# EasyEDA Pro project PRJ_Feeder.epro, board Rail_PCB
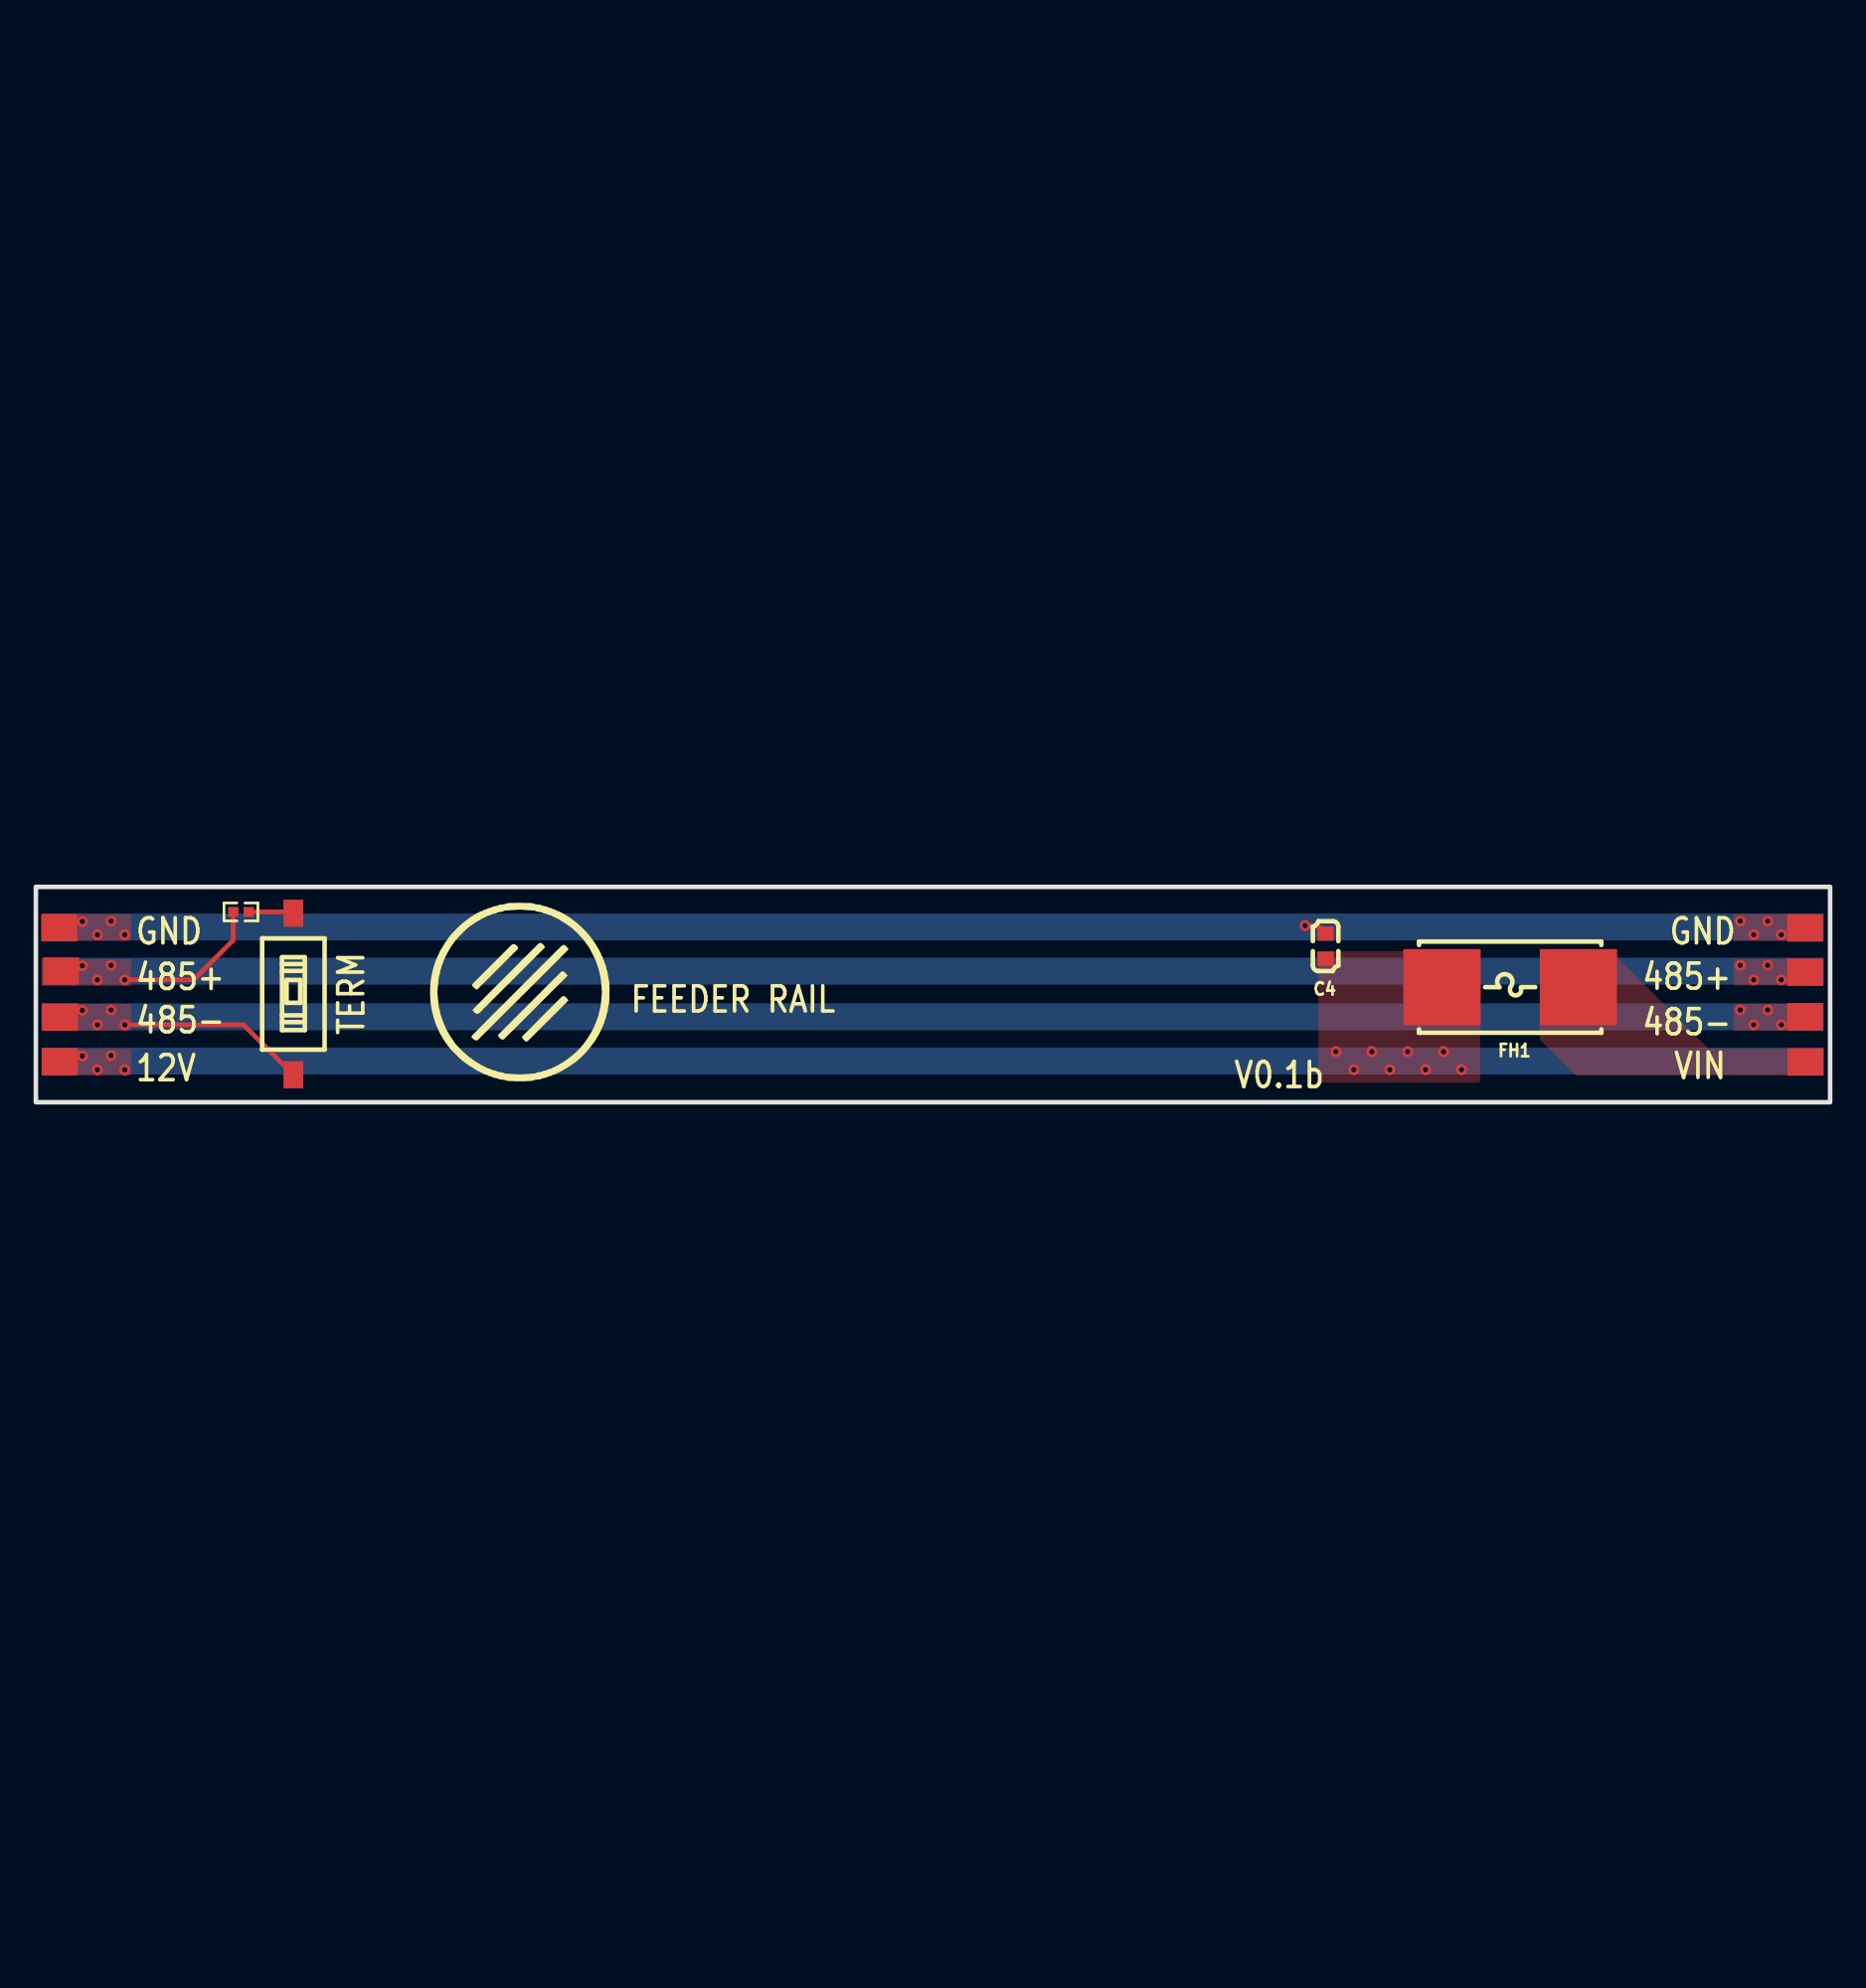
[diagram p8: board, top side]
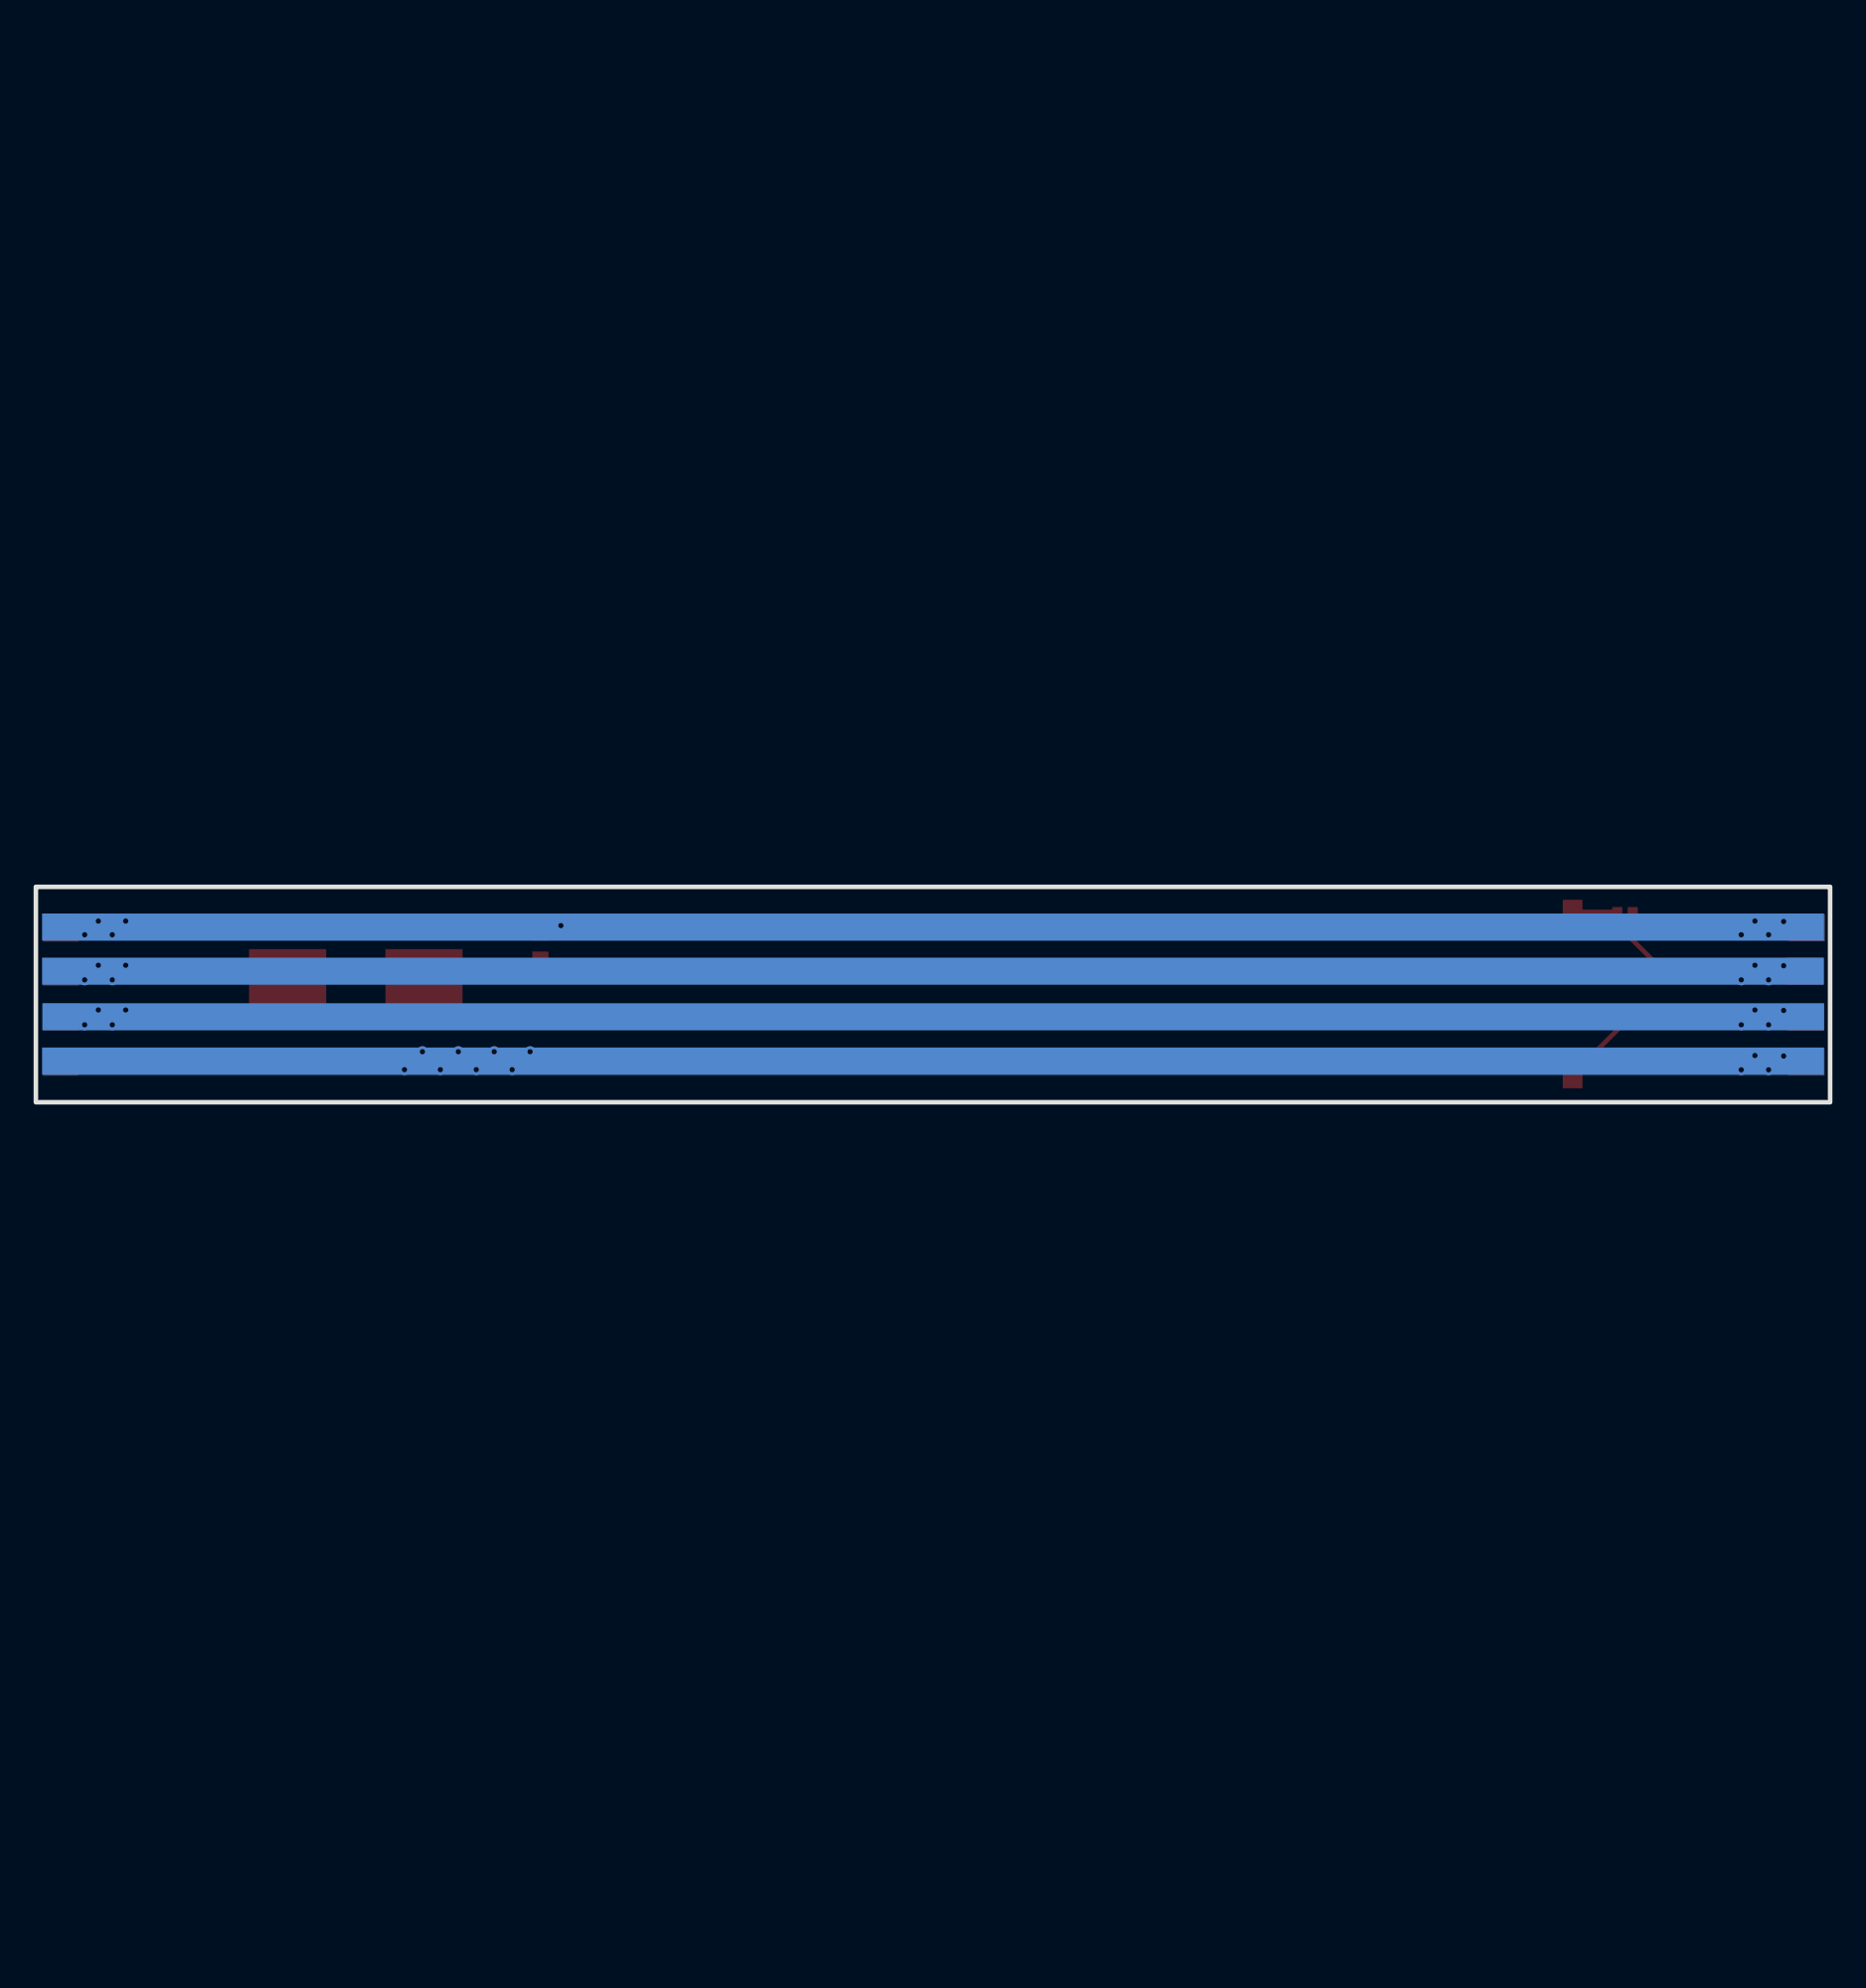
[diagram p9: board, bottom side, seen from below]

Outline 100 x 12 mm; copper layers: Top Layer, Bottom Layer. Coordinates in mm from the lower left corner of the outline.
Outline path: rectangle 0,12 100,0
Stack: Top Layer 0.035mm / Dielectric1 1.51mm FR4 er 4.5 / Bottom Layer 0.035mm

## Design rules (mm)
template: Custom Config
spacing copperThickness1oz (default): track to track 0.102, other pairs 0.152 to 0.3
spacing copperThickness2oz: track to track 0.203, other pairs 0.152 to 0.3
track width copperThickness1oz (default): min 0.127, default 0.254, max 2.54
track width copperThickness2oz: min 0.203, default 0.254, max 2.54
differential pair differentialPair (default): width min 0.127, default 0.254, max 2.54; gap min 0.152, default 0.152
via viaSize (default): diameter min 0.5, default 0.61, max 10; hole min 0.3, default 0.305, max 6.3

## Placement (name value [footprint] x y rotation side)
C4  10uF  [C0603]  71.88 8.7 270 top
FH1  01550900M  [FUSE-SMD_L9.8-W5.0]  82.17 6.41 0 top
NOREF  -  [Pad_e257]  98.63 2.25 0 top
NOREF#2  -  [Pad_e261]  1.4 7.3 0 top
NOREF#3  -  [Pad_e265]  50 7.3 0 top
NOREF#4  -  [Pad_e266]  49.99 4.76 0 top
NOREF#5  -  [Pad_e253]  98.6 9.71 0 top
NOREF#6  -  [Pad_e267]  50 2.3 0 top
NOREF#7  -  [Pad_e260]  1.35 4.74 0 top
NOREF#8  -  [Pad_e264]  50 9.77 0 top
NOREF#9  -  [Pad_e256]  98.6 4.76 0 top
NOREF#10  -  [Pad_e255]  98.6 7.25 0 top
NOREF#11  -  [Pad_e262]  1.33 2.26 0 top
NOREF#12  -  [Pad_e259]  1.3 9.73 0 top
R1  120Ω  [R0402]  11.43 10.6 180 top
SW1  DSIC01LS-P  [SW-SMD_2P-L3.5-W6.2-P2.54-LS9.8]  14.35 6.03 90 top

## Footprints (pads in the part's own frame, mm; a bottom-side part is the same pattern mirrored in y, then rotated)
C0603
  rect 0.8x0.9 smd: 1(-0.7,0) 2(0.7,0)
FUSE-SMD_L9.8-W5.0
  rect 4.3x4.24 smd: 1(-3.8,0) 2(3.8,0)
Pad_e253
  rect 2x1.524 smd: 1(0,0)
Pad_e255
  rect 2x1.524 smd: 1(0,0)
Pad_e256
  rect 2x1.524 smd: 1(0,0)
Pad_e257
  rect 2x1.524 smd: 1(0,0)
Pad_e259
  rect 2x1.524 smd: 1(0,0)
Pad_e260
  rect 2x1.524 smd: 1(0,0)
Pad_e261
  rect 2x1.524 smd: 1(0,0)
Pad_e262
  rect 2x1.524 smd: 1(0,0)
Pad_e264
  rect 99.3x1.5 smd far side: 1(0,0)
Pad_e265
  rect 99.3x1.5 smd far side: 1(0,0)
Pad_e266
  rect 99.3x1.5 smd far side: 1(0,0)
Pad_e267
  rect 99.3x1.5 smd far side: 1(0,0)
R0402
  rect 0.566x0.54 smd: 1(-0.433,0) 2(0.433,0)
SW-SMD_2P-L3.5-W6.2-P2.54-LS9.8
  rect 1.5x1.1 smd: 1(-4.5,0) 2(4.5,0)

## Nets
12V: C4.2 FH1.1 NOREF#6.1 NOREF#11.1
GND: C4.1 NOREF#5.1 NOREF#8.1 NOREF#12.1
VIN: FH1.2 NOREF.1
485+: NOREF#2.1 NOREF#3.1 NOREF#10.1 R1.2
485-: NOREF#4.1 NOREF#7.1 NOREF#9.1 SW1.1
$1N358: R1.1 SW1.2

## Via types
v1: diameter 0.61, hole 0.305, Top Layer to Bottom Layer, 37 vias

## Routing (per net, layer and track width the routed paths; a pad name or vN(x,y) marks a point on that pad's centre or on a via; arc(x,y) is an arc through that point)
12V:
  vias: v1(2.59,2.58) v1(3.43,1.81) v1(4.19,2.6) v1(4.95,1.81) v1(72.46,2.82) v1(73.46,1.82) v1(74.46,2.82) v1(75.46,1.82) v1(76.46,2.82) v1(77.46,1.82) v1(78.46,2.82) v1(79.46,1.82)
GND: length 1.3
  Top Layer w0.254: v1(70.74,9.84) 71.44,9.84 C4.1
  vias: v1(2.59,10.07) v1(3.43,9.33) v1(4.19,10.09) v1(4.95,9.33) v1(95,10.09) v1(95.74,9.33) v1(96.52,10.09) v1(97.28,9.33)
485+: length 8.5
  Top Layer w0.254: R1.2 11,9.03 8.79,6.82 v1(4.95,6.82)
  vias: v1(2.59,7.61) v1(3.43,6.82) v1(4.19,7.63) v1(95,7.63) v1(95.74,6.82) v1(96.52,7.63) v1(97.28,6.82)
485-: length 10.6
  Top Layer w0.254: SW1.1 11.57,4.31 v1(4.95,4.31)
  vias: v1(2.59,5.12) v1(3.43,4.31) v1(4.19,5.14) v1(95,5.14) v1(95.74,4.31) v1(96.52,5.14) v1(97.28,4.31)
$1N358: length 2.5
  Top Layer w0.254: SW1.2 14.28,10.6 R1.1

## Copper pours and planes (outline as drawn; the poured copper is in the pictures)
12V on Top Layer: 0.3,2.98 5.3,2.98 5.3,1.48 0.3,1.48
12V on Top Layer: 71.48,8.42 80.49,8.42 80.49,1.09 71.48,1.09
12V on Bottom Layer: 0.3,2.98 99.6,2.98 99.6,1.48 0.3,1.48
GND on Top Layer: 94.6,10.48 99.6,10.48 99.6,8.98 94.6,8.98
GND on Top Layer: 0.3,10.48 5.3,10.48 5.3,8.98 0.3,8.98
GND on Bottom Layer: 0.3,10.48 99.6,10.48 99.6,8.98 0.3,8.98
VIN on Top Layer: 83.82,8.44 95.81,8.44 95.81,1.48 83.82,1.48
VIN on Top Layer: 94.6,2.98 99.6,2.98 99.6,1.48 94.6,1.48
485+ on Top Layer: 0.3,7.98 5.3,7.98 5.3,6.48 0.3,6.48
485+ on Top Layer: 94.63,8.01 99.63,8.01 99.63,6.51 94.63,6.51
485- on Top Layer: 94.6,5.48 99.6,5.48 99.6,3.98 94.6,3.98
485- on Top Layer: 0.3,5.48 5.3,5.48 5.3,3.98 0.3,3.98

## Text on the board
Top Silkscreen Layer: GND | 485+ | 485- | 12V | FEEDER RAIL | VIN | TERM | V0.1b
